# EasyEDA Pro project ProDoc_PCB_LEDLampPCB_4_2024-10-25.epro

# Board PCB_Circuit Wenglor_4
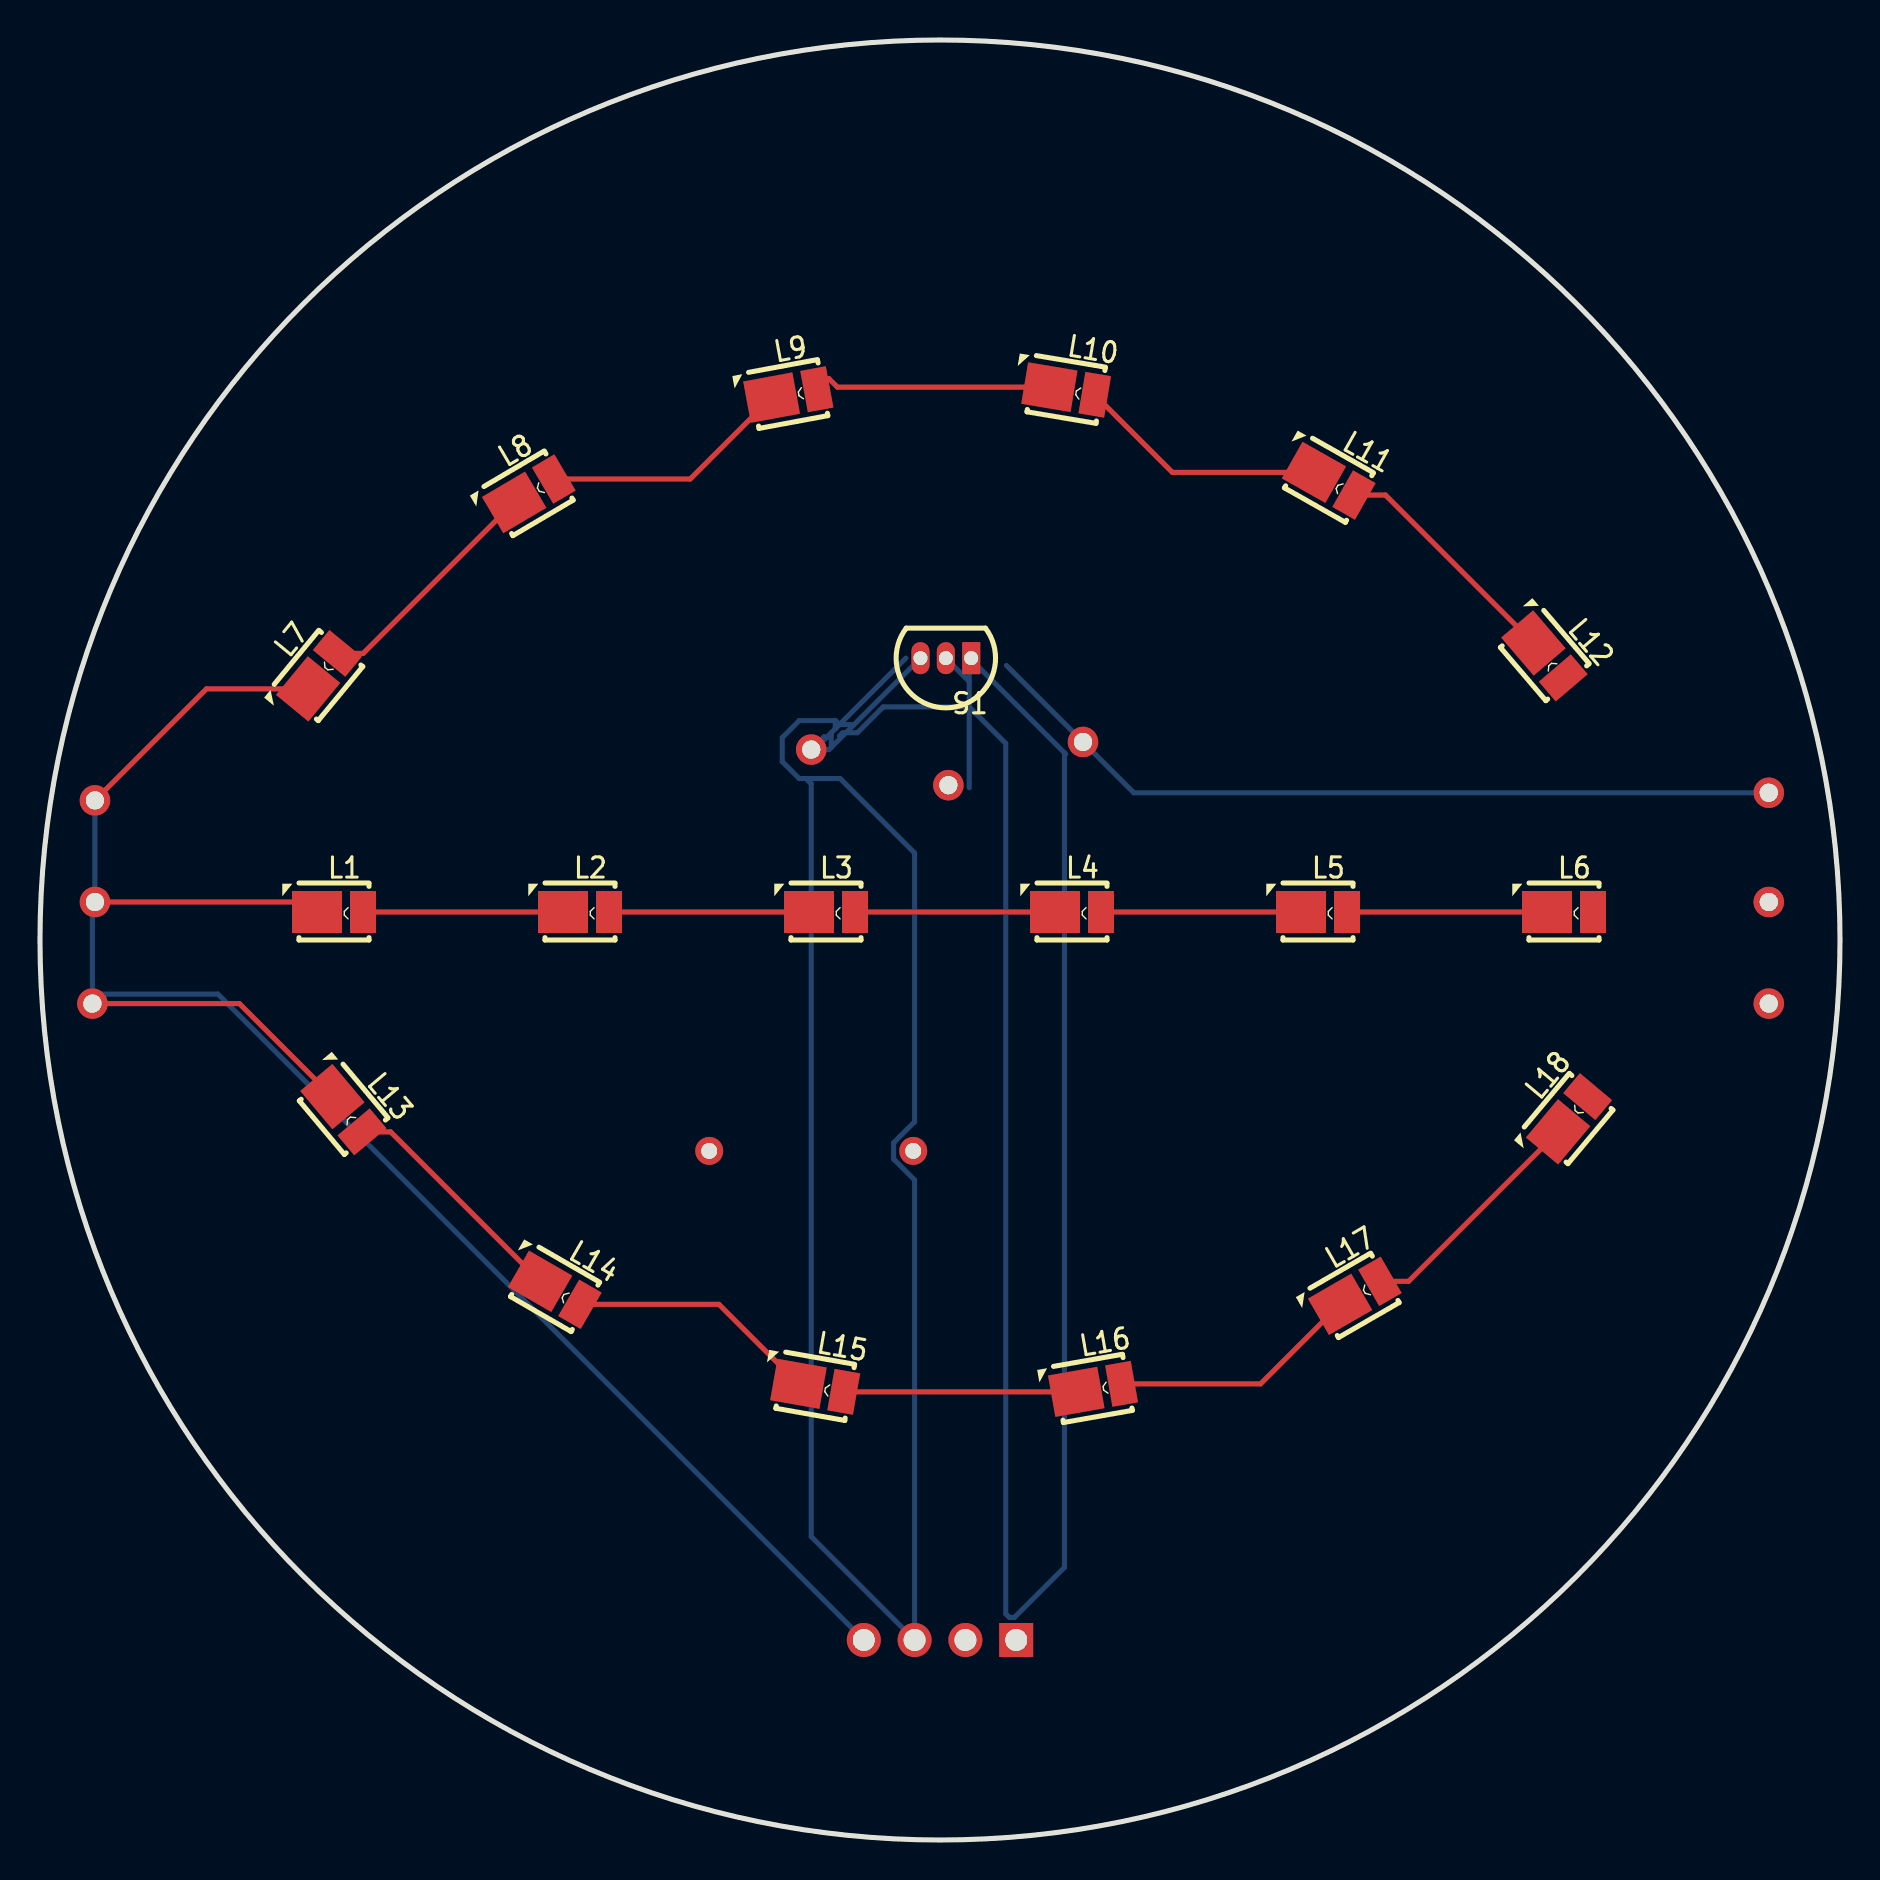
[diagram p0: board, top side]
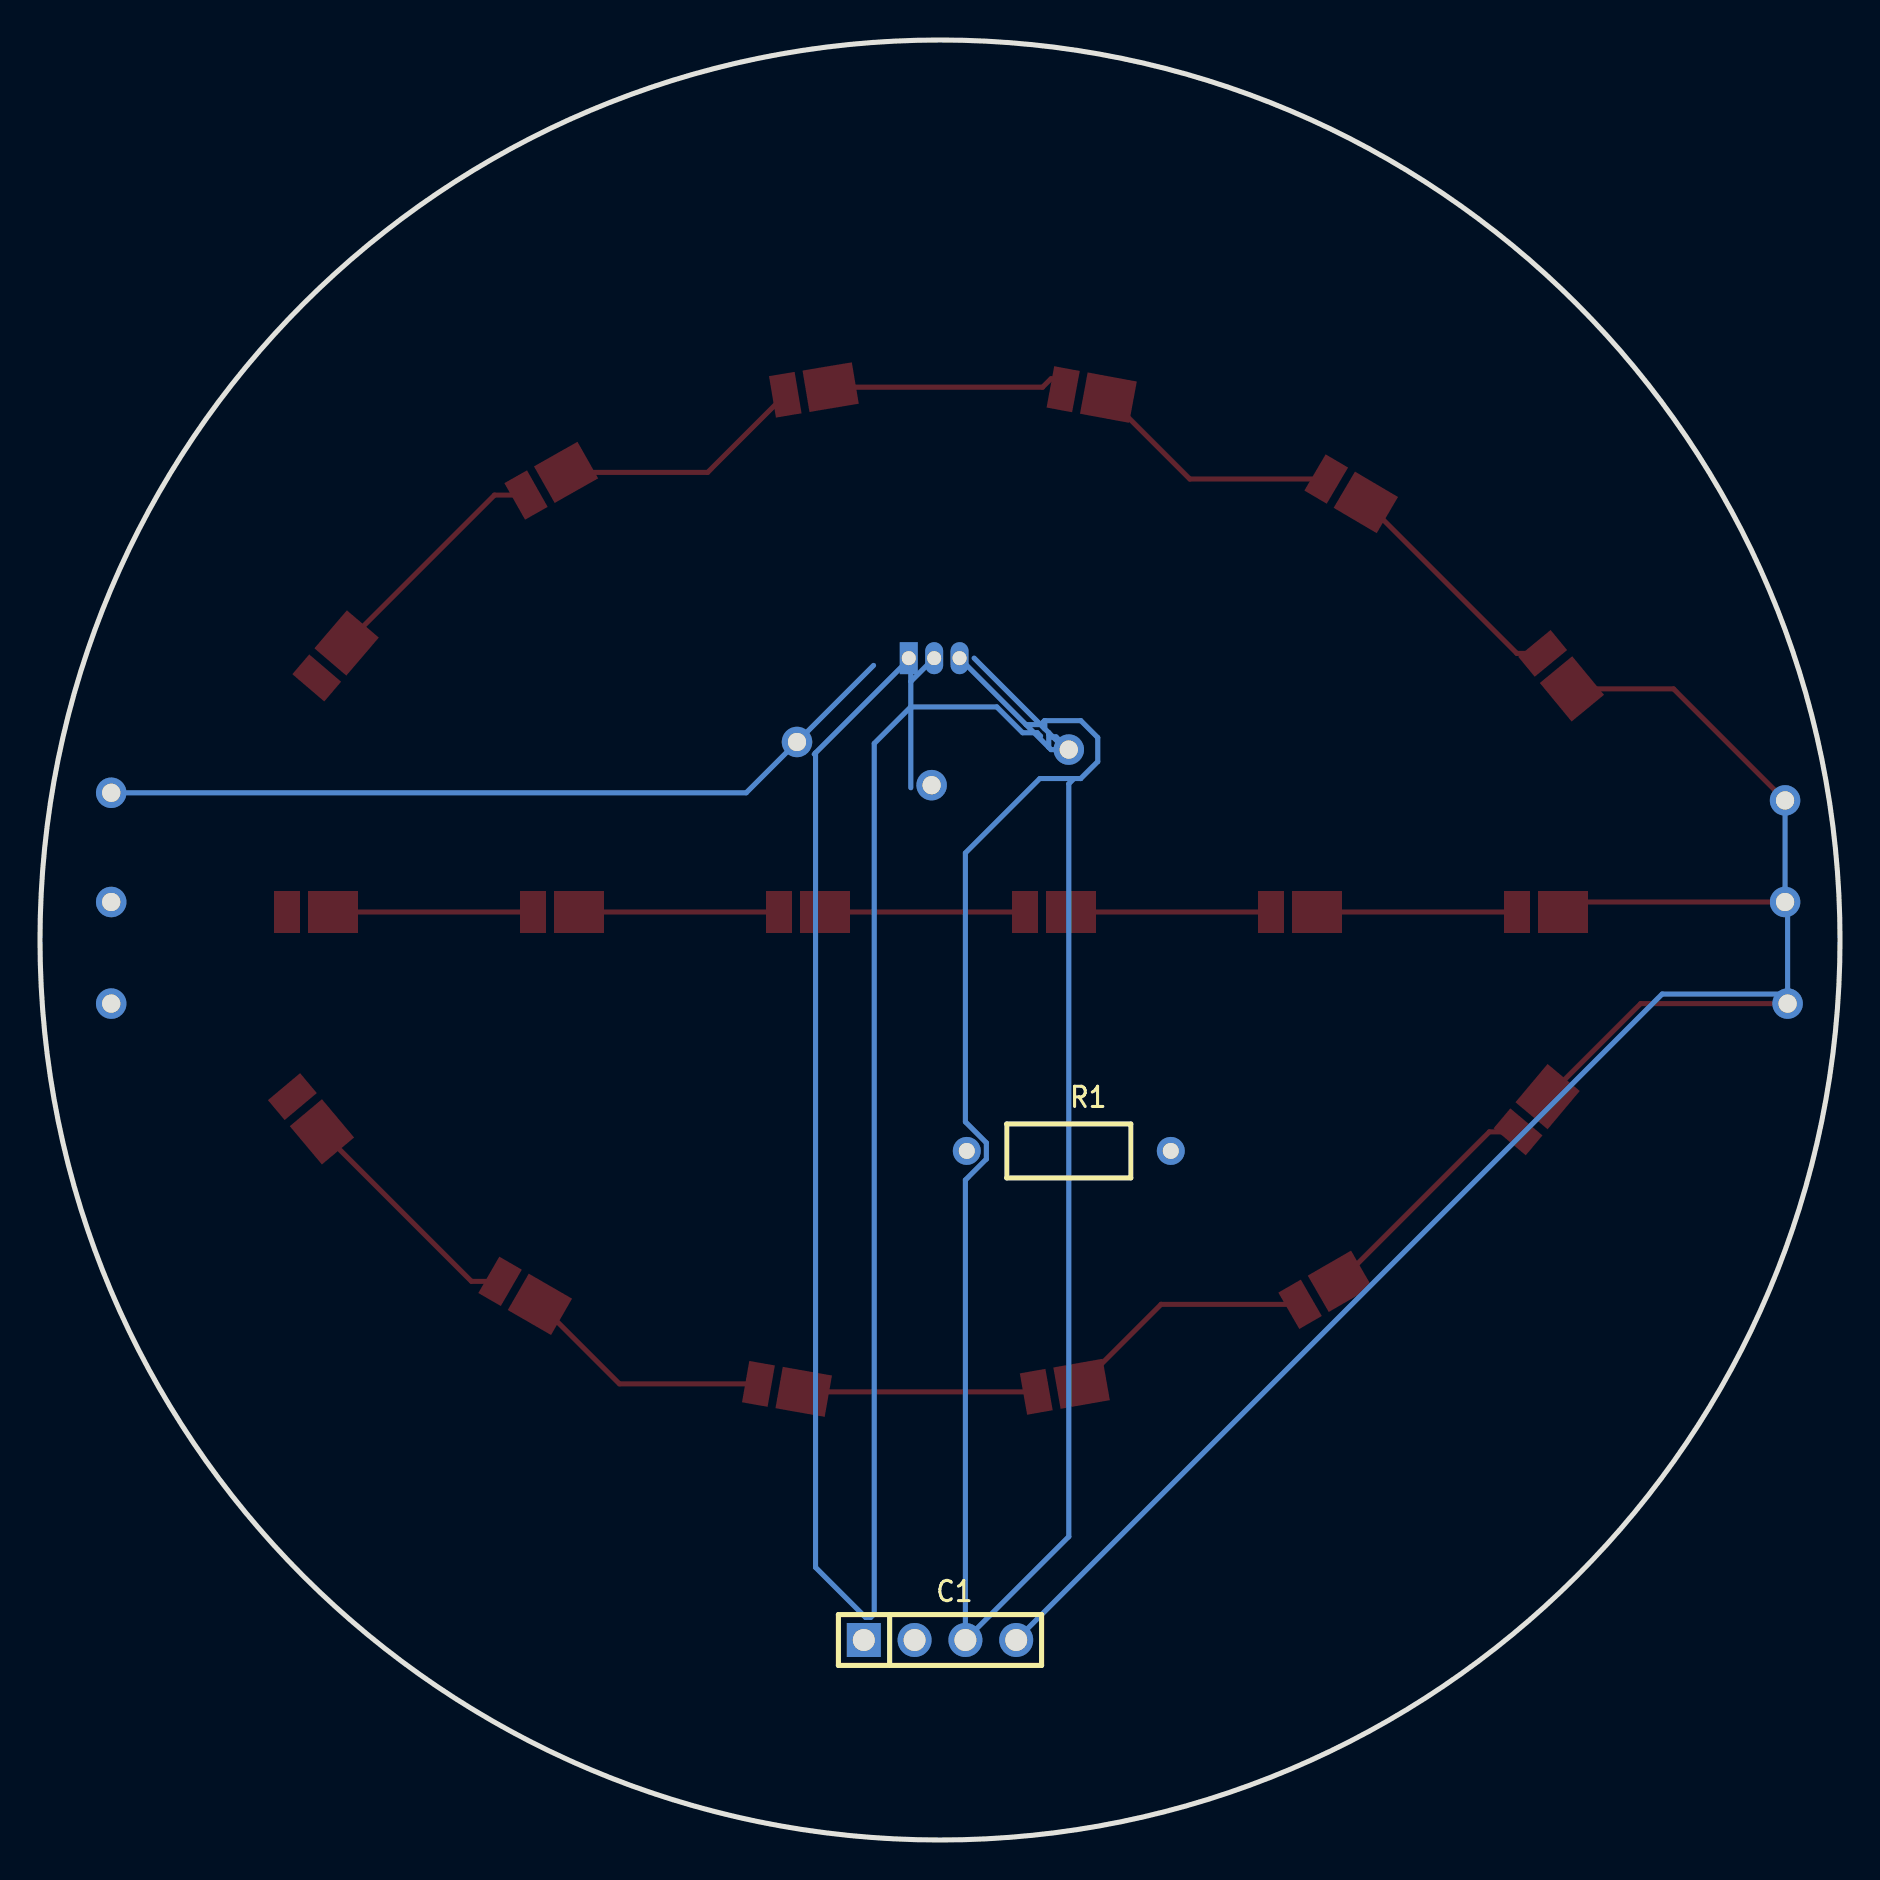
[diagram p1: board, bottom side, seen from below]

Outline 90 x 90 mm; copper layers: Top Layer, Bottom Layer. Coordinates in mm from the lower left corner of the outline.
Outline path: circle c45,45 r45
Stack: Top Layer 0.035mm / Dielectric1 1.51mm FR4 er 4.5 / Bottom Layer 0.035mm

## Design rules (mm)
spacing Default (default): track to track 0.152, other pairs 0 to 0.152
track width Default (default): min 0.254, default 0.254, max 25.4
differential pair differentialPair (default): width min 0.127, default 0.254, max 2.54; gap min 0.152, default 0.152
via Default (default): diameter min 0.61, default 0.61, max 100.025; hole min 0.305, default 0.305, max 59.995

## Placement (name value [footprint] x y rotation side)
C1  -  [HDR-TH_4P-P2.54-V-M]  45 10 180 bottom
L1  -  [LED-SMD_L3.5-W2.8-RD_WHITE_A]  15 46.4 0 top
L2  -  [LED-SMD_L3.5-W2.8-RD_WHITE_A]  27.3 46.4 0 top
L3  -  [LED-SMD_L3.5-W2.8-RD_WHITE_A]  39.6 46.4 0 top
L4  -  [LED-SMD_L3.5-W2.8-RD_WHITE_A]  51.9 46.4 0 top
L5  -  [LED-SMD_L3.5-W2.8-RD_WHITE_A]  64.2 46.4 0 top
L6  -  [LED-SMD_L3.5-W2.8-RD_WHITE_A]  76.5 46.4 0 top
L7  -  [LED-SMD_L3.5-W2.8-RD_WHITE_A]  14.13 58.44 50.5 top
L8  -  [LED-SMD_L3.5-W2.8-RD_WHITE_A]  24.7 67.47 30.5 top
L9  -  [LED-SMD_L3.5-W2.8-RD_WHITE_A]  37.71 72.33 10.5 top
L10  -  [LED-SMD_L3.5-W2.8-RD_WHITE_A]  51.6 72.45 350.5 top
L11  -  [LED-SMD_L3.5-W2.8-RD_WHITE_A]  64.7 67.81 330.5 top
L12  -  [LED-SMD_L3.5-W2.8-RD_WHITE_A]  75.42 58.98 310.5 top
L13  -  [LED-SMD_L3.5-W2.8-RD_WHITE_A]  15.36 36.29 310 top
L14  -  [LED-SMD_L3.5-W2.8-RD_WHITE_A]  26 27.36 330 top
L15  -  [LED-SMD_L3.5-W2.8-RD_WHITE_A]  39.05 22.61 350 top
L16  -  [LED-SMD_L3.5-W2.8-RD_WHITE_A]  52.95 22.61 10 top
L17  -  [LED-SMD_L3.5-W2.8-RD_WHITE_A]  66 27.36 30 top
L18  -  [LED-SMD_L3.5-W2.8-RD_WHITE_A]  76.64 36.29 50 top
NOREF  -  [Pad_e303]  86.44 46.9 0 top
NOREF#2  -  [Pad_e302]  86.44 52.36 0 top
NOREF#3  -  [Pad_e300]  2.75 46.9 0 top
NOREF#4  -  [Pad_e301]  2.62 41.82 0 top
NOREF#5  -  [Pad_e306]  45.42 52.74 0 top
NOREF#6  -  [Pad_e307]  38.56 54.52 0 top
NOREF#7  -  [Pad_e305]  52.15 54.9 0 top
NOREF#8  -  [Pad_e304]  86.44 41.82 0 top
NOREF#9  -  [Pad_e299]  2.75 51.98 0 top
R1  -  [RES-TH_BD2.7-L6.2-P10.20-D0.4]  38.56 34.45 180 bottom
S1  -  [TO-92-3_L4.9-W3.7-P1.27-L]  45.29 59.09 180 top

## Footprints (pads in the part's own frame, mm; a bottom-side part is the same pattern mirrored in y, then rotated)
HDR-TH_4P-P2.54-V-M
  rect 1.7x1.7 hole 1.1: 1(-3.81,0)
  round 1.7 hole 1.1: 2(-1.27,0) 3(1.27,0) 4(3.81,0)
LED-SMD_L3.5-W2.8-RD_WHITE_A
  rect 2.5x2.1 smd: 1(-1.15,0)
  rect 1.3x2.1 smd: 2(1.15,0)
Pad_e299
  round 1.524 hole 0.914: 1(0,0)
Pad_e300
  round 1.524 hole 0.914: 2(0,0)
Pad_e301
  round 1.524 hole 0.914: 3(0,0)
Pad_e302
  round 1.524 hole 0.914: 4(0,0)
Pad_e303
  round 1.524 hole 0.914: 5(0,0)
Pad_e304
  round 1.524 hole 0.914: 6(0,0)
Pad_e305
  round 1.524 hole 0.914: 7(0,0)
Pad_e306
  round 1.524 hole 0.914: 8(0,0)
Pad_e307
  round 1.524 hole 0.914: 10(0,0)
RES-TH_BD2.7-L6.2-P10.20-D0.4
  round 1.4 hole 0.8: 1(-5.1,0) 2(5.1,0)
TO-92-3_L4.9-W3.7-P1.27-L
  rect 0.9x1.6 hole 0.7: 1(-1.27,0)
  oval 0.9x1.6 hole 0.7: 2(0,0) 3(1.27,0)

## Nets
S$4072: L7.2 L8.1
S$4079: L8.2 L9.1
S$4086: L9.2 L10.1
S$4093: L10.2 L11.1
S$4100: L11.2 L12.1
S$4173: C1.4 L1.1 L7.1 L13.1 NOREF#3.2 NOREF#4.3 NOREF#9.1
S$4197: L1.2 L2.1
S$4204: L2.2 L3.1
S$4208: L3.2 L4.1
S$4212: L4.2 L5.1
S$4216: L5.2 L6.1
S$4223: C1.1 L6.2 L12.2 L18.2 NOREF.5 NOREF#2.4 NOREF#7.7 NOREF#8.6 S1.1
S$4315: L13.2 L14.1
S$4325: L14.2 L15.1
S$4335: L15.2 L16.1
S$4339: L16.2 L17.1
S$4346: L17.2 L18.1
S$4957: C1.2 NOREF#5.8 R1.1 S1.2
S$8149: C1.3 NOREF#6.10 R1.2 S1.3

## Routing (per net, layer and track width the routed paths; a pad name or vN(x,y) marks a point on that pad's centre or on a via; arc(x,y) is an arc through that point)
(no net): length 113
  Bottom Layer w0.254: 46.6,58.98 51.22,54.36 ; 46.6,58.98 46.56,59.02 46.56,59.09 ; 46.6,58.98 46.46,58.84 46.46,57.92 ; 46.6,58.98 46.71,59.09 ; 51.22,54.36 51.29,54.29 ; 51.22,54.36 51.22,13.63 48.72,11.13 48.47,11.13 48.29,11.31 48.29,54.83 46.46,56.65 ; 46.46,57.92 46.46,56.65 ; 46.46,57.92 45.29,59.09 ; 46.46,56.65 42.16,56.65 40.87,55.36 40.14,55.36 39.97,55.19 ; 46.46,56.65 46.46,52.62
S$4072: length 12
  Top Layer w0.254: L8.1 16.16,59.33 L7.2
S$4079: length 12.6
  Top Layer w0.254: 25.69,68.05 32.51,68.05 L9.1
S$4086: length 12.1
  Top Layer w0.254: L10.1 39.87,72.64 39.45,73.06 39.2,73.06 38.84,72.71 38.84,72.54
S$4093: length 12.6
  Top Layer w0.254: L11.1 56.62,68.38 L10.2
S$4100: length 12
  Top Layer w0.254: 65.7,67.25 67.27,67.25 74.67,59.85
S$4173: length 99.9
  Top Layer w0.254: L7.1 8.32,57.56 NOREF#9.1 ; 14.62,37.17 9.97,41.82 NOREF#4.3 ; L1.1 13.35,46.9 NOREF#3.2
  Bottom Layer w0.254: 3.1,42.3 8.89,42.3 C1.4 ; NOREF#9.1 NOREF#3.2 2.62,46.77 NOREF#4.3
S$4197: length 10
  Top Layer w0.254: L1.2 L2.1
S$4204: length 10
  Top Layer w0.254: L2.2 L3.1
S$4208: length 10
  Top Layer w0.254: L3.2 L4.1
S$4212: length 10
  Top Layer w0.254: L4.2 L5.1
S$4216: length 10
  Top Layer w0.254: L5.2 L6.1
S$4223: length 40.6
  Bottom Layer w0.254: 86.32,52.36 54.69,52.36 NOREF#7.7 48.32,58.73
S$4315: length 12
  Top Layer w0.254: L13.2 17.53,35.41 L14.1
S$4325: length 12.6
  Top Layer w0.254: L14.2 33.94,26.78 L15.1
S$4335: length 11.6
  Top Layer w0.254: 40.19,22.41 51.81,22.41
S$4339: length 12.6
  Top Layer w0.254: L16.2 61.03,22.81 L17.1
S$4346: length 12
  Top Layer w0.254: L17.2 68.43,27.93 L18.1
S$8149: length 116
  Bottom Layer w0.254: 43.29,59.09 39.97,55.77 ; 39.97,55.77 40.7,55.77 ; 39.97,55.77 39.85,55.65 ; 39.36,55.16 38.82,54.62 ; 39.36,55.16 39.2,55.16 38.66,54.62 ; 39.36,55.16 39.56,55.36 ; 39.36,55.16 39.44,55.16 39.56,55.28 ; 38.82,54.62 38.66,54.62 ; 38.82,54.62 38.72,54.52 ; 39.56,55.36 39.56,55.28 ; 39.56,55.36 39.76,55.56 ; 39.56,55.28 39.56,54.63 ; 40.7,55.77 39.56,54.63 ; 40.7,55.77 S1.3 ; 39.56,54.63 39.45,54.52 38.72,54.52 ; 38.66,54.62 38.46,54.62 ; 38.66,54.62 NOREF#6.10 38.72,54.52 ; 39.76,55.56 39.76,55.96 39.75,55.97 ; 39.76,55.56 39.85,55.65 ; 39.75,55.97 39.77,55.97 39.85,55.89 39.85,55.65 ; 39.75,55.97 37.96,55.97 37.11,55.12 37.11,53.92 37.96,53.07 38.3,53.07 ; 38.3,53.07 40.01,53.07 43.73,49.35 43.73,35.91 42.68,34.86 42.68,34.05 43.73,33 C1.3 38.56,15.17 38.56,52.81 38.3,53.07
